# EasyEDA Pro project Summer Robot.eprj, schematic Relay Driver Unit
Board Name: Relay Driver Unit; Create Date: 2025-05-18; Page Name: P1; Project Name: Summer Robot; Schematic Name: Relay Driver Unit; Update Date: 2025-05-19; Company: EasyEDA.com; Page Size: A4; Version: V1.0
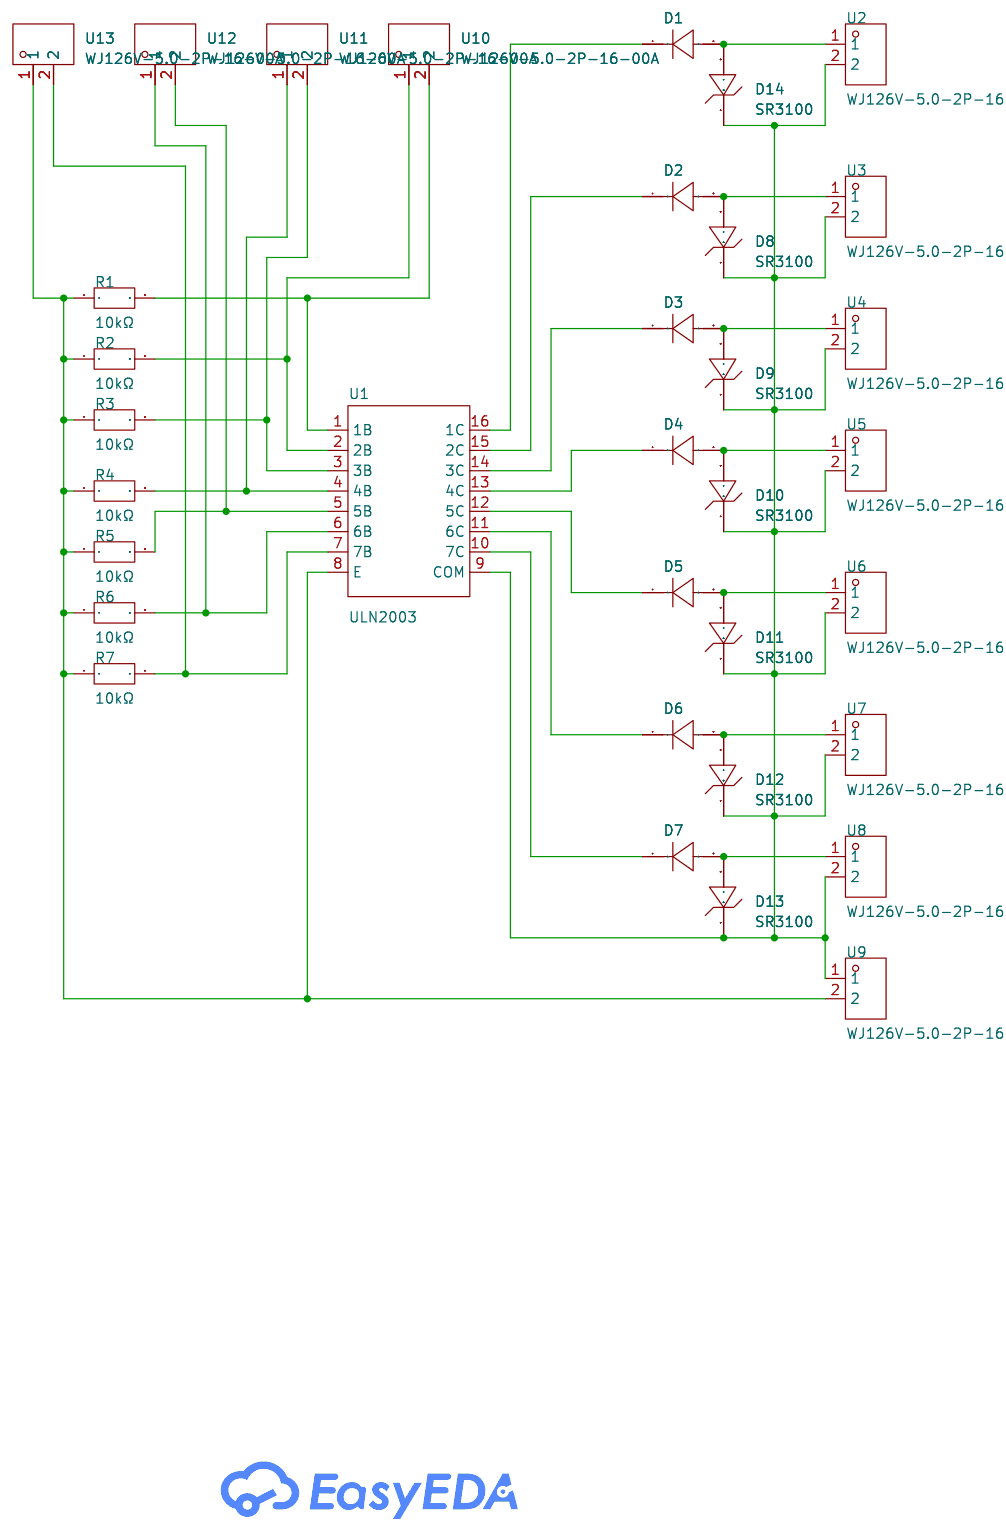
[diagram p3: schematic sheet]

## Parts
D1  -  [DO-41_BD2.4-L4.7-P8.70-D0.9-RD]
D2  -  [DO-41_BD2.4-L4.7-P8.70-D0.9-RD]
D3  -  [DO-41_BD2.4-L4.7-P8.70-D0.9-RD]
D4  -  [DO-41_BD2.4-L4.7-P8.70-D0.9-RD]
D5  -  [DO-41_BD2.4-L4.7-P8.70-D0.9-RD]
D6  -  [DO-41_BD2.4-L4.7-P8.70-D0.9-RD]
D7  -  [DO-41_BD2.4-L4.7-P8.70-D0.9-RD]
D8  SR3100  [DO-27_BD5.2-L8.9-P12.90-D1.5-RD]
D9  SR3100  [DO-27_BD5.2-L8.9-P12.90-D1.5-RD]
D10  SR3100  [DO-27_BD5.2-L8.9-P12.90-D1.5-RD]
D11  SR3100  [DO-27_BD5.2-L8.9-P12.90-D1.5-RD]
D12  SR3100  [DO-27_BD5.2-L8.9-P12.90-D1.5-RD]
D13  SR3100  [DO-27_BD5.2-L8.9-P12.90-D1.5-RD]
D14  SR3100  [DO-27_BD5.2-L8.9-P12.90-D1.5-RD]
R1  10kΩ  [RES-TH_BD2.4-L6.3-P10.30-D0.6]
R2  10kΩ  [RES-TH_BD2.4-L6.3-P10.30-D0.6]
R3  10kΩ  [RES-TH_BD2.4-L6.3-P10.30-D0.6]
R4  10kΩ  [RES-TH_BD2.4-L6.3-P10.30-D0.6]
R5  10kΩ  [RES-TH_BD2.4-L6.3-P10.30-D0.6]
R6  10kΩ  [RES-TH_BD2.4-L6.3-P10.30-D0.6]
R7  10kΩ  [RES-TH_BD2.4-L6.3-P10.30-D0.6]
U1  ULN2003  [DIP-16_L19.2-W6.6-P2.54-LS7.6-BL]
U2  WJ126V-5.0-2P-16-00A  [CONN-TH_WJ126V-5.0-2P]
U3  WJ126V-5.0-2P-16-00A  [CONN-TH_WJ126V-5.0-2P]
U4  WJ126V-5.0-2P-16-00A  [CONN-TH_WJ126V-5.0-2P]
U5  WJ126V-5.0-2P-16-00A  [CONN-TH_WJ126V-5.0-2P]
U6  WJ126V-5.0-2P-16-00A  [CONN-TH_WJ126V-5.0-2P]
U7  WJ126V-5.0-2P-16-00A  [CONN-TH_WJ126V-5.0-2P]
U8  WJ126V-5.0-2P-16-00A  [CONN-TH_WJ126V-5.0-2P]
U9  WJ126V-5.0-2P-16-00A  [CONN-TH_WJ126V-5.0-2P]
U10  WJ126V-5.0-2P-16-00A  [CONN-TH_WJ126V-5.0-2P]
U11  WJ126V-5.0-2P-16-00A  [CONN-TH_WJ126V-5.0-2P]
U12  WJ126V-5.0-2P-16-00A  [CONN-TH_WJ126V-5.0-2P]
U13  WJ126V-5.0-2P-16-00A  [CONN-TH_WJ126V-5.0-2P]

## Library data of the parts
D1-D7 = 1N4007: Supplier Footprint: DO-41
D8-D14 = SR3100_C402291: LCSC Part Name: 电压:100V 电流:3A; Supplier Part: C402291; Manufacturer: LGE(鲁光); Supplier Footprint: DO-27; JLCPCB Part Class: Extended Part; Datasheet: https://atta.szlcsc.com/upload/public/pdf/source/20190705/C402293_92C4D8B797E3ECB762557B3141A428BE.pdf; Supplier: LCSC; Diode Configuration: Independent Type; Voltage - Forward(Vf@If): 850mV@3A; Voltage - DC Reverse(Vr): 100V; Current - Rectified: 3A; Reverse Leakage Current (Ir): 100uA@100V
R1-R7 = RN1/4W10KFT/BA1: LCSC Part Name: 10kΩ ±1% 250mW 金属膜电阻; Supplier Part: C410695; Manufacturer: Tyohm(幸亚电阻); Supplier Footprint: 插件,D2.4xL6.5mm; JLCPCB Part Class: Extended Part; Datasheet: https://atta.szlcsc.com/upload/public/pdf/source/20250211/2C0505E212032D72CE625B2E6B5197BA.pdf; Supplier: LCSC; Type: Metal Film Resistors; Tolerance: ±1%; Voltage-Supply(Max): 250V; Power(Watts): 1/4W; Temperature Coefficient: ±50ppm/℃; Operating Temperature: -55℃~+125℃
U1 = ULN2003_C6851442: number of channels:Seven channels Maximum collector Emitter Voltage (Vceo):50V Collector Current(Ic):- maximum input voltage:30V Operating Temperature:- Operating Temperature:-; LCSC Part Name: 七路 Vceo: 50V 电压(VI): 30V; Supplier Part: C6851442; Manufacturer: HXY MOSFET(华轩阳电子); Supplier Footprint: SOP-16; JLCPCB Part Class: Extended Part; Datasheet: https://atta.szlcsc.com/upload/public/pdf/source/20230526/BF18AFD4628411B197E7B7E814422353.pdf; Supplier: LCSC; number of channels: Seven channels; Maximum collector Emitter Voltage (Vceo): 50V; maximum input voltage: 30V
U2-U13 = WJ126V-5.0-2P-16-00A: LCSC Part Name: 直插式/5.0mm 2P 红色; Supplier Part: C3031437; Manufacturer: KANGNEX(康奈克斯电气); Supplier Footprint: P=5mm; JLCPCB Part Class: Extended Part; Datasheet: https://atta.szlcsc.com/upload/public/pdf/source/20191225/C8379_3D37D98EF6F0ECCD8D2EB72C93E46299.pdf; Supplier: LCSC

## Nets
$1N276: D2.1(K) U1.15(2C)
$1N301: D3.1(K) U1.14(3C)
$1N326: D4.1(K) U1.13(4C)
$1N351: D5.1(K) U1.12(5C)
$1N376: D6.1(K) U1.11(6C)
$1N401: D7.1(K) U1.10(7C)
$1N426: D1.1(K) U1.16(1C)
$1N702: D1.2(A) D14.2(A) U2.1
$1N715: D2.2(A) D8.2(A) U3.1
$1N718: D3.2(A) D9.2(A) U4.1
$1N723: D4.2(A) D10.2(A) U5.1
$1N728: D5.2(A) D11.2(A) U6.1
$1N733: D7.2(A) D13.2(A) U8.1
$1N738: D6.2(A) D12.2(A) U7.1
$1N780: R1.2 U1.1(1B) U10.2
$1N819: R2.2 U1.2(2B) U10.1
$1N858: R3.2 U1.3(3B) U11.2
$1N897: R4.2 U1.4(4B) U11.1
$1N936: R5.2 U1.5(5B) U12.2
$1N975: R6.2 U1.6(6B) U12.1
$1N1014: R7.2 U1.7(7B) U13.2
$1N3496: D8.1(C) D9.1(C) D10.1(C) D11.1(C) D12.1(C) D13.1(C) D14.1(C) U1.9(COM) U2.2 U3.2 U4.2 U5.2 U6.2 U7.2 U8.2 U9.1
$1N3515: R1.1 R2.1 R3.1 R4.1 R5.1 R6.1 R7.1 U1.8(E) U9.2 U13.1
